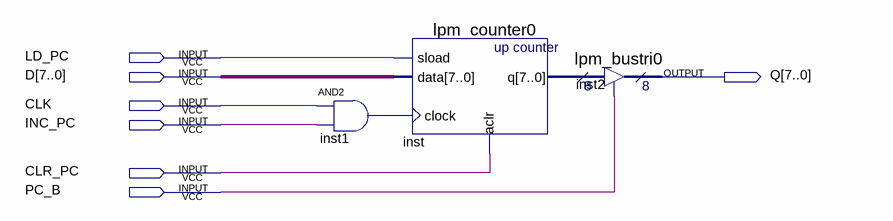
[diagram p0: schematic sheet]
// Quartus schematic PC.bdf as structural Verilog: 3 symbols, 7 pins
module PC (
  input  LD_PC,
  input  [7:0] D,
  input  CLK,
  input  INC_PC,
  input  CLR_PC,
  input  PC_B,
  output [7:0] Q
);

  wire inst1_out;
  wire [7:0] inst_q;

  and inst1 (inst1_out, CLK, INC_PC);
  lpm_counter0 inst (.sload(LD_PC), .data(D), .clock(inst1_out), .aclr(CLR_PC), .q(inst_q));
  lpm_bustri0 inst2 (.enabledt(PC_B), .data(inst_q), .tridata(Q));
endmodule
